# Altium schematic sheet STM32H7_PART_1.SchDoc
size A; Organization: Altium Limited; Address1: L3, 12a Rodborough Rd; Address2: Frenchs Forest; Address3: NSW; Address4: Australia 2086
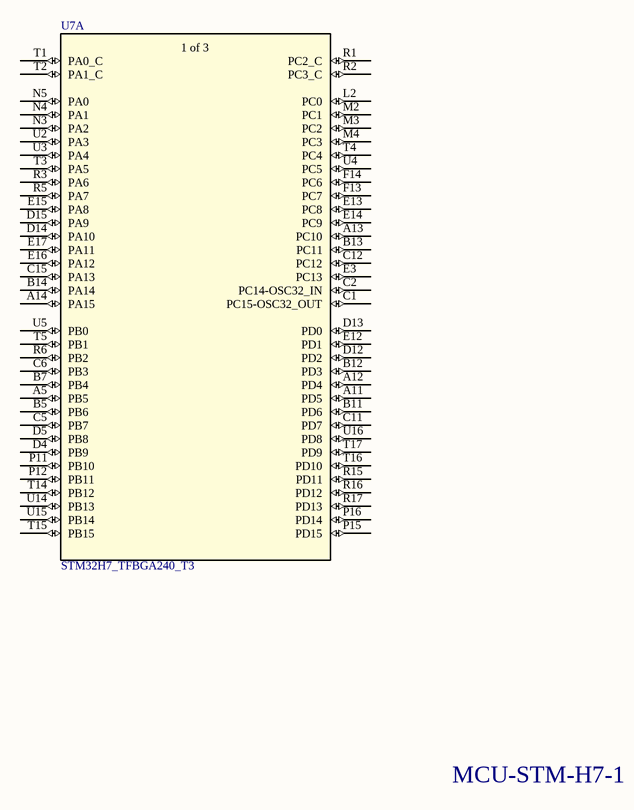
[diagram p0: STM32H7_PART_1.SchDoc]

## Parts
U7  STM32H7_TFBGA240_T3  [TFBGA240+25]  (part A of 4)

## Nets

Not connected (* = marked no-connect by the designer): U7 A5(PB5) A11(PD5) A12(PD4) A13(PC10) A14(PA15) B5(PB6) B7(PB4) B11(PD6) B12(PD3) B13(PC11) B14(PA14) C1(PC15-OSC32_OUT) C2(PC14-OSC32_IN) C5(PB7) C6(PB3) C11(PD7) C12(PC12) C15(PA13) D4(PB9) D5(PB8) D12(PD2) D13(PD0) D14(PA10) D15(PA9) E3(PC13) E12(PD1) E13(PC8) E14(PC9) E15(PA8) E16(PA12) E17(PA11) F13(PC7) F14(PC6) L2(PC0) M2(PC1) M3(PC2) M4(PC3) N3(PA2) N4(PA1) N5(PA0) P11(PB10) P12(PB11) P15(PD15) P16(PD14) R1(PC2_C) R2(PC3_C) R3(PA6) R5(PA7) R6(PB2) R15(PD11) R16(PD12) R17(PD13) T1(PA0_C) T2(PA1_C) T3(PA5) T4(PC4) T5(PB1) T14(PB12) T15(PB15) T16(PD10) T17(PD9) U2(PA3) U3(PA4) U4(PC5) U5(PB0) U14(PB13) U15(PB14) U16(PD8)

## Notes on the sheet
- MCU-STM-H7-1
- Title
- Size:
- Date:
- A
- Number:
- Time:
- Revision:
- Sheet
- of
- File:
- (in symbol STM32H7_TFBGA240, part A) 1 of 3

## Library data of the parts
U7 = STM32H7_TFBGA240: No Description Available; Vendor: STMicroelectronics; Copyright: Copyright (C) 2018 Accelerated Designs. All rights reserved; Manufacturer_Part_Number: STM32H7_TFBGA240_T3; RefDes: RefDes; Type: DEV